# EasyEDA Pro project motor.eprj

# Schematic AO3400V1
Create Date: 2023-12-16; Page Name: AO3400V1; Project Name: motor; Schematic Name: AO3400V1; Update Date: 2023-12-17; Company: 嘉立创EDA; Page Size: A4; Version: V1.0
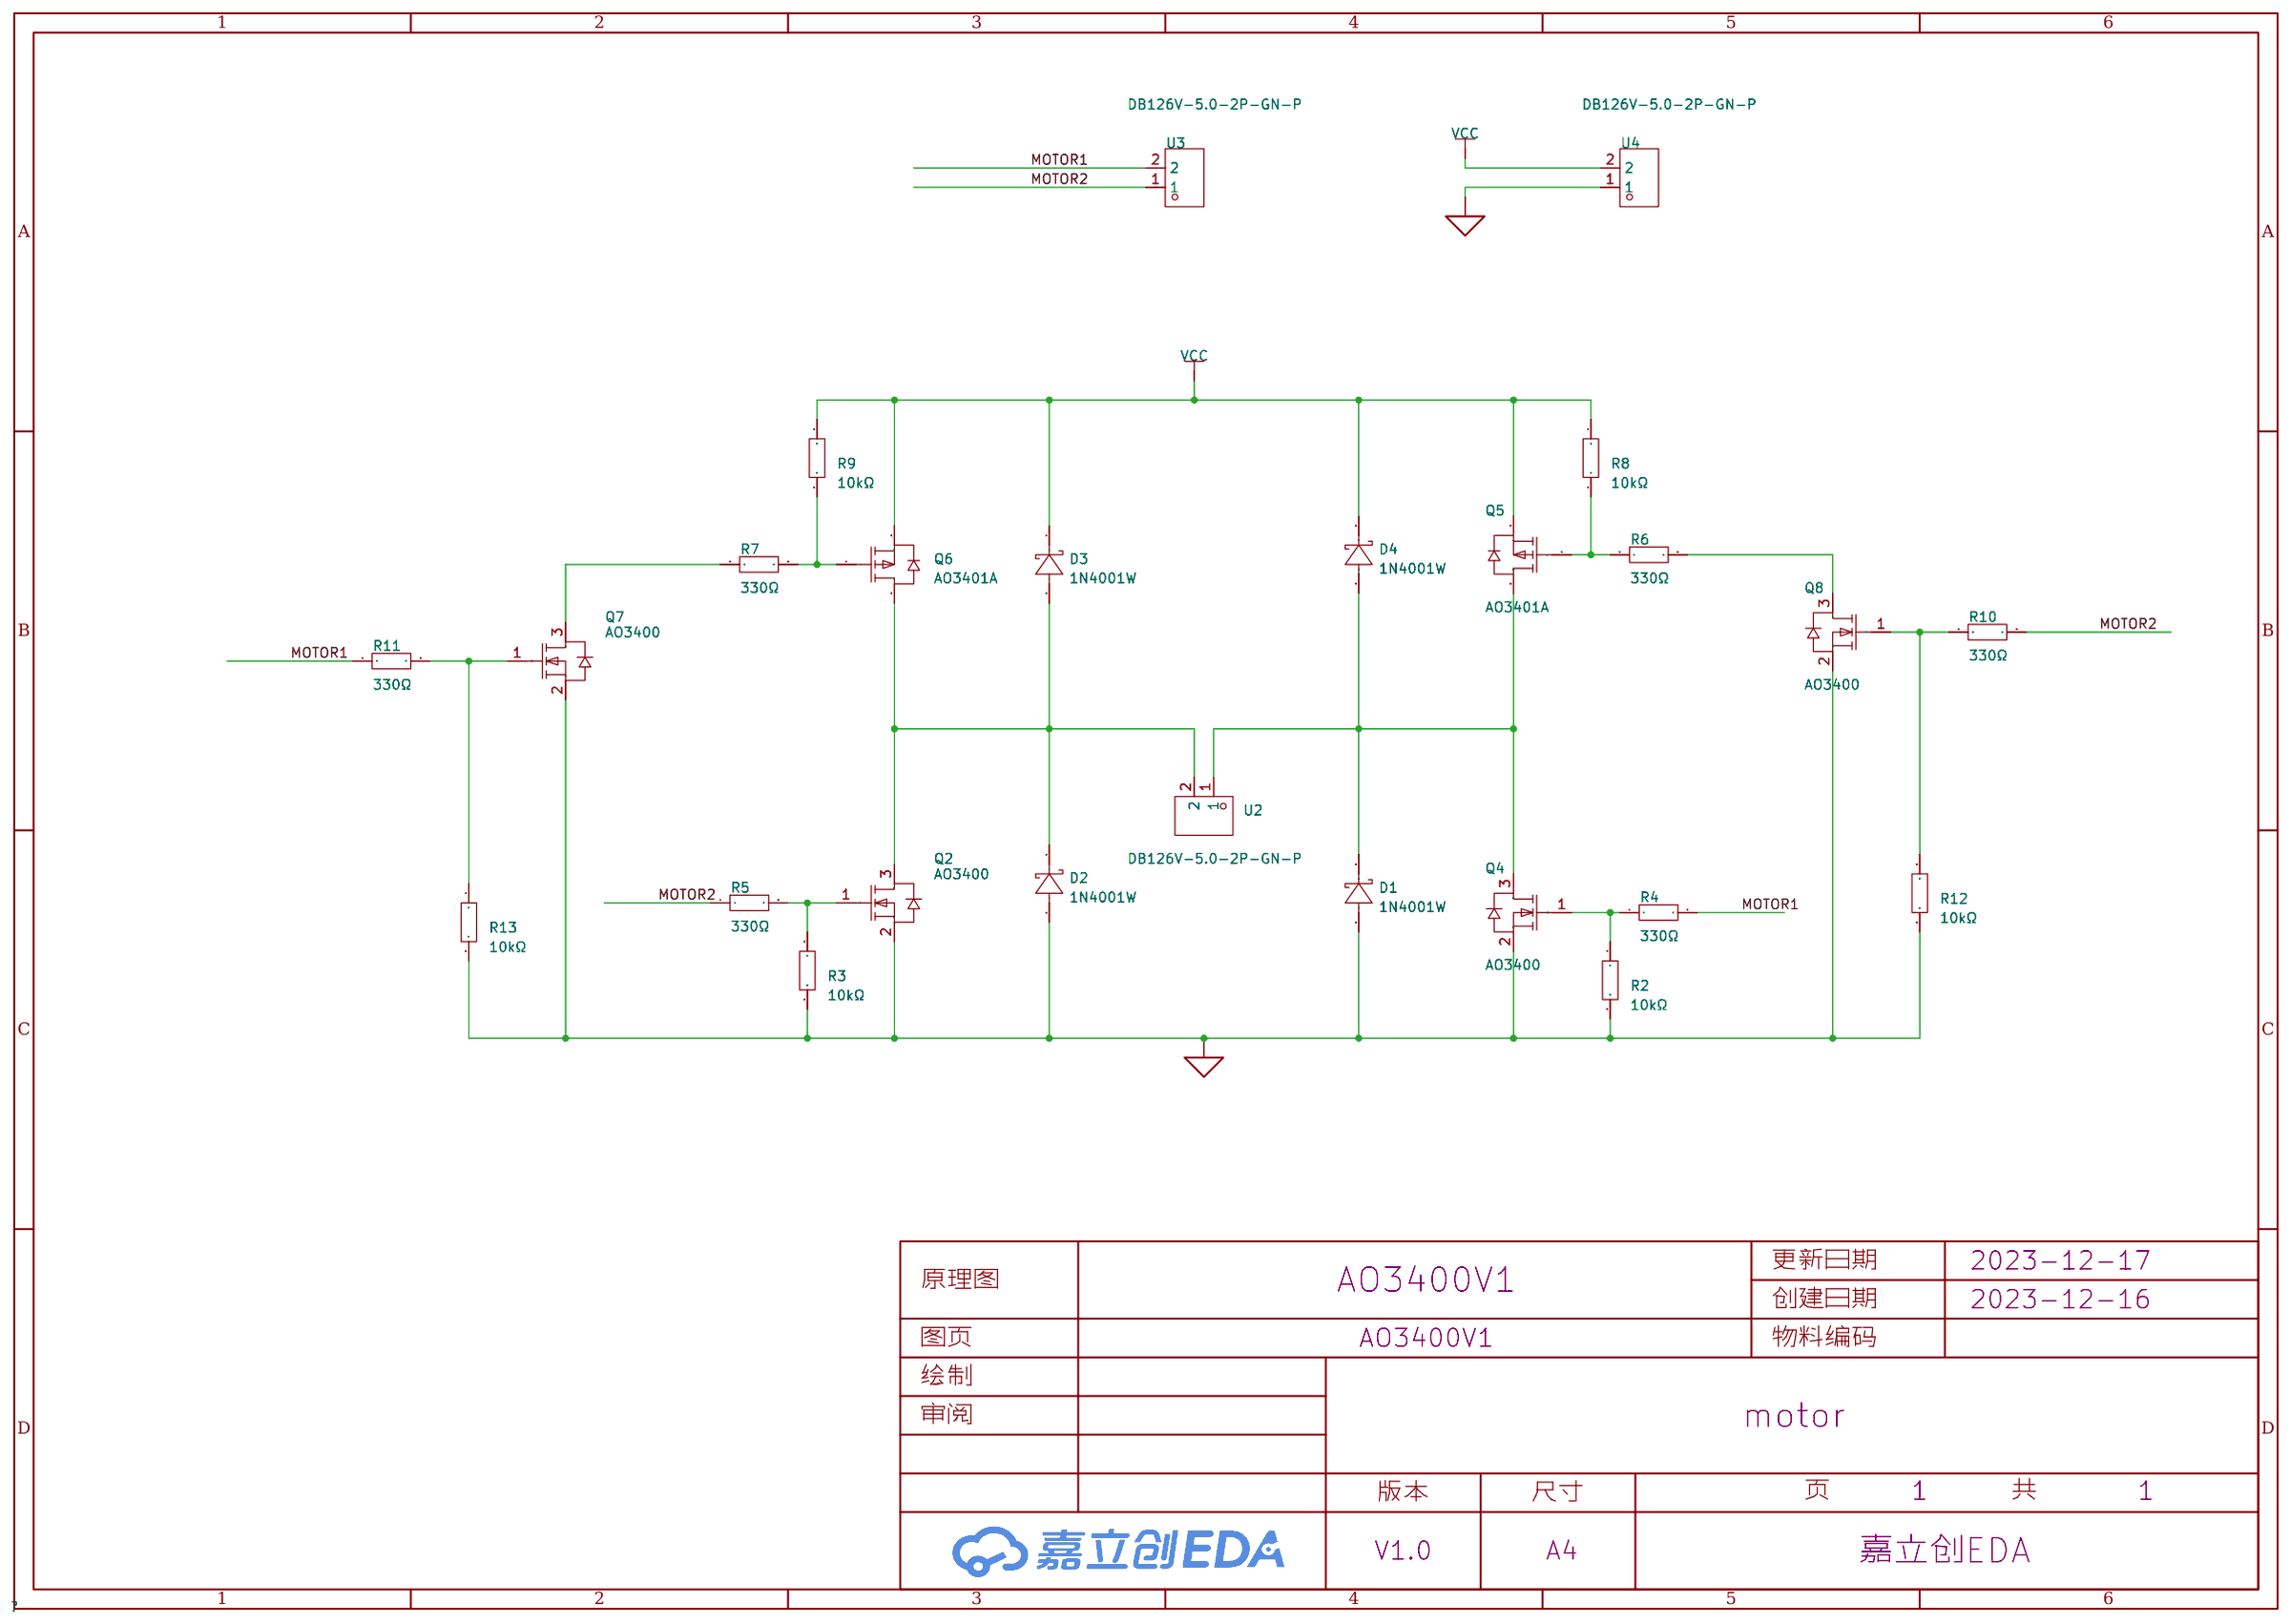
[diagram p0: schematic sheet]

## Parts
D1  1N4001W  [SOD-123FL_L2.7-W1.8-LS3.8-RD]
D2  1N4001W  [SOD-123FL_L2.7-W1.8-LS3.8-RD]
D3  1N4001W  [SOD-123FL_L2.7-W1.8-LS3.8-RD]
D4  1N4001W  [SOD-123FL_L2.7-W1.8-LS3.8-RD]
Q2  AO3400  [SOT-23_L2.9-W1.3-P1.90-LS2.4-BR]
Q4  AO3400  [SOT-23_L2.9-W1.3-P1.90-LS2.4-BR]
Q5  AO3401A  [SOT-23_L2.9-W1.3-P1.90-LS2.4-BR]
Q6  AO3401A  [SOT-23_L2.9-W1.3-P1.90-LS2.4-BR]
Q7  AO3400  [SOT-23_L2.9-W1.3-P1.90-LS2.4-BR]
Q8  AO3400  [SOT-23_L2.9-W1.3-P1.90-LS2.4-BR]
R2  10kΩ  [R0603]
R3  10kΩ  [R0603]
R4  330Ω  [R0603]
R5  330Ω  [R0603]
R6  330Ω  [R0603]
R7  330Ω  [R0603]
R8  10kΩ  [R0603]
R9  10kΩ  [R0603]
R10  330Ω  [R0603]
R11  330Ω  [R0603]
R12  10kΩ  [R0603]
R13  10kΩ  [R0603]
U2  DB126V-5.0-2P-GN-P  [CONN-TH_2P-P5.00_L7.8-W10.0]
U3  DB126V-5.0-2P-GN-P  [CONN-TH_2P-P5.00_L7.8-W10.0]
U4  DB126V-5.0-2P-GN-P  [CONN-TH_2P-P5.00_L7.8-W10.0]

## Library data of the parts
D1-D4 = 1N4001W_C18199085: 二极管配置:独立式;正向压降(Vf):1V@1.0A;直流反向耐压(Vr):50V;平均整流电流(Io):1A;; LCSC Part Name: 电压:50V 电流:1A; Supplier Part: C18199085; Manufacturer: 宏迦橙; Supplier Footprint: SOD-123FL; JLCPCB Part Class: Extended Part; Datasheet: https://atta.szlcsc.com/upload/public/pdf/source/20230925/B0AB2B510D392D7083D021E804ED238F.pdf; Supplier: LCSC; Diode Configuration: 独立式; Forward Voltage (Vf@If): 1V@1.0A; Reverse Voltage (Vr): 50V; Average Rectified Current (Io): 1A; Reverse Leakage Current: 2uA@50V
Q2 Q4 Q7 Q8 = AO3400_C2938367: 类型:N沟道;漏源电压(Vdss):30V;连续漏极电流(Id):5.8A;功率(Pd):1.5W;导通电阻(RDS(on)@Vgs,Id):35mΩ@10V,5.8A;阈值电压(Vgs(th)@Id):1.2V@250uA;; LCSC Part Name: N沟道 耐压:30V 电流:5.8A; Supplier Part: C2938367; Manufacturer: GOODWORK(固得沃克); Supplier Footprint: SOT-23; JLCPCB Part Class: 扩展库; Datasheet: https://atta.szlcsc.com/upload/public/pdf/source/20211229/1DE691E24B5B31BB262C463D0489A9AB.pdf; Supplier: LCSC; Type: N沟道; Drain Source Voltage (Vdss): 30V; Continuous Drain Current (Id): 5.8A; Power Dissipation (Pd): 1.5W; Drain Source On Resistance (RDS(on)@Vgs,Id): 35mΩ@10V,5.8A; Gate Threshold Voltage (Vgs(th)@Id): 1.2V@250uA; Input Capacitance (Ciss@Vds): 1.05nF@15V; Reverse Transfer Capacitance (Crss@Vds): 77pF@15V; Operating Temperature: +150℃@(Tj)
Q5 Q6 = AO3401A_C15127: 类型:1个P沟道;漏源电压(Vdss):30V;连续漏极电流(Id):4A;功率(Pd):1.4W;导通电阻(RDS(on)@Vgs,Id):44mΩ@10V,4.3A;阈值电压(Vgs(th)@Id):1.3V@250uA;; LCSC Part Name: 1个P沟道 耐压:30V 电流:4A; Supplier Part: C15127; Manufacturer: AOS; Supplier Footprint: SOT-23; JLCPCB Part Class: 基础库; Datasheet: https://atta.szlcsc.com/upload/public/pdf/source/20160507/1462613609053.pdf; Supplier: LCSC; Type: 1个P沟道; Drain Source Voltage (Vdss): 30V; Continuous Drain Current (Id): 4A; Power Dissipation (Pd): 1.4W; Drain Source On Resistance (RDS(on)@Vgs,Id): 44mΩ@10V,4.3A; Gate Threshold Voltage (Vgs(th)@Id): 1.3V@250uA; Total Gate Charge (Qg@Vgs): 12.2nC@4.5V; Input Capacitance (Ciss@Vds): 1.2nF@15V; Operating Temperature: -55℃~+150℃@(Tj)
R2 R3 R8 R9 R12 R13 = 0603WAF1002T5E: 阻值:10kΩ;精度:±1%;功率:100mW;温度系数:±100ppm/℃;电阻类型:厚膜电阻;; LCSC Part Name: 10kΩ ±1% 100mW 厚膜电阻; Supplier Part: C25804; Manufacturer: UNI-ROYAL(厚声); Supplier Footprint: 0603; JLCPCB Part Class: 基础库; Datasheet: https://atta.szlcsc.com/upload/public/pdf/source/20200306/C422600_1E6D84923E4A46A82E41ADD87F860B5C.pdf; Supplier: LCSC; Tolerance: ±1%; Power(Watts): 100mW; Overload Voltage (Max): 75V; Temperature Coefficient: ±100ppm/℃; Type: 厚膜电阻; Operating Temperature Range: -55℃~+155℃
R4-R7 R10 R11 = 0603WAF3300T5E: 电阻类型:厚膜电阻;阻值:330Ω;精度:±1%;功率:100mW;最大工作电压:75V;温度系数:±100ppm/℃;; LCSC Part Name: 330Ω ±1% 100mW 厚膜电阻; Supplier Part: C23138; Manufacturer: UNI-ROYAL(厚声); Supplier Footprint: 0603; JLCPCB Part Class: 基础库; Datasheet: https://atta.szlcsc.com/upload/public/pdf/source/20200306/C422600_1E6D84923E4A46A82E41ADD87F860B5C.pdf; Supplier: LCSC; Type: 厚膜电阻; Tolerance: ±1%; Power(Watts): 100mW; Overload Voltage (Max): 75V; Temperature Coefficient: ±100ppm/℃; Operating Temperature Range: -55℃~+155℃
U2-U4 = DB126V-5.0-2P-GN-P: 间距:5mm;结构:1x2P;排数:1;每排PIN数:2;安装方式:直插;额定电流:15A;额定电压:250V;线规 - AWG:14~26;线规 - mm2:1.5;工作温度范围:-40℃~+105℃;颜色:绿色;; LCSC Part Name: 5mm 1x2P 排数:1 每排P数:2 直插; Supplier Part: C395849; Manufacturer: DIBO(地博电气); Supplier Footprint: 插件,P=5mm; JLCPCB Part Class: 扩展库; Datasheet: https://atta.szlcsc.com/upload/public/pdf/source/20230406/A033F46F5FECA00BC1B8D9A3F749A51C.pdf; Supplier: LCSC; Pitch: 5mm; Structure: 1x2P; Number of Rows: 1; Number of PINs Per Row: 2; Mounting Style: 直插; Current Rating (Max): 15A; Voltage Rating (Max): 250V; Wire Gauge - AWG: 14~26; Wire Gauge - mm2: 1.5; Operating Temperature Range: -40℃~+105℃; Color: 绿色; Number of Pins: 2P

## Nets
AGND: D1.2(A) D2.2(A) Q2.2(S) Q4.2(S) Q7.2(S) Q8.2(S) R2.2 R3.2 R12.2 R13.2 U4.1
VCC: D3.1(K) D4.1(K) Q5.2(S) Q6.2(S) R8.1 R9.1 U4.2
MOTOR1: R4.2 R11.1 U3.2
MOTOR2: R5.1 R10.2 U3.1
$1N1584: Q2.1(G) R3.1 R5.2
$1N1607: D2.1(K) D3.2(A) Q2.3(D) Q6.3(D) U2.2
$1N1619: Q4.1(G) R2.1 R4.1
$1N1736: D1.1(K) D4.2(A) Q4.3(D) Q5.3(D) U2.1
$1N2290: Q5.1(G) R6.1 R8.2
$1N2329: Q6.1(G) R7.2 R9.2
$1N2487: Q7.3(D) R7.1
$1N2533: Q8.3(D) R6.2
$1N2573: Q8.1(G) R10.1 R12.1
$1N2612: Q7.1(G) R11.2 R13.1

# Schematic SS8050V1
Create Date: 2024-06-09; Page Name: P1; Project Name: motor; Schematic Name: SS8050V1; Update Date: 2024-06-09; Company: 嘉立创EDA; Page Size: A4; Version: V1.0
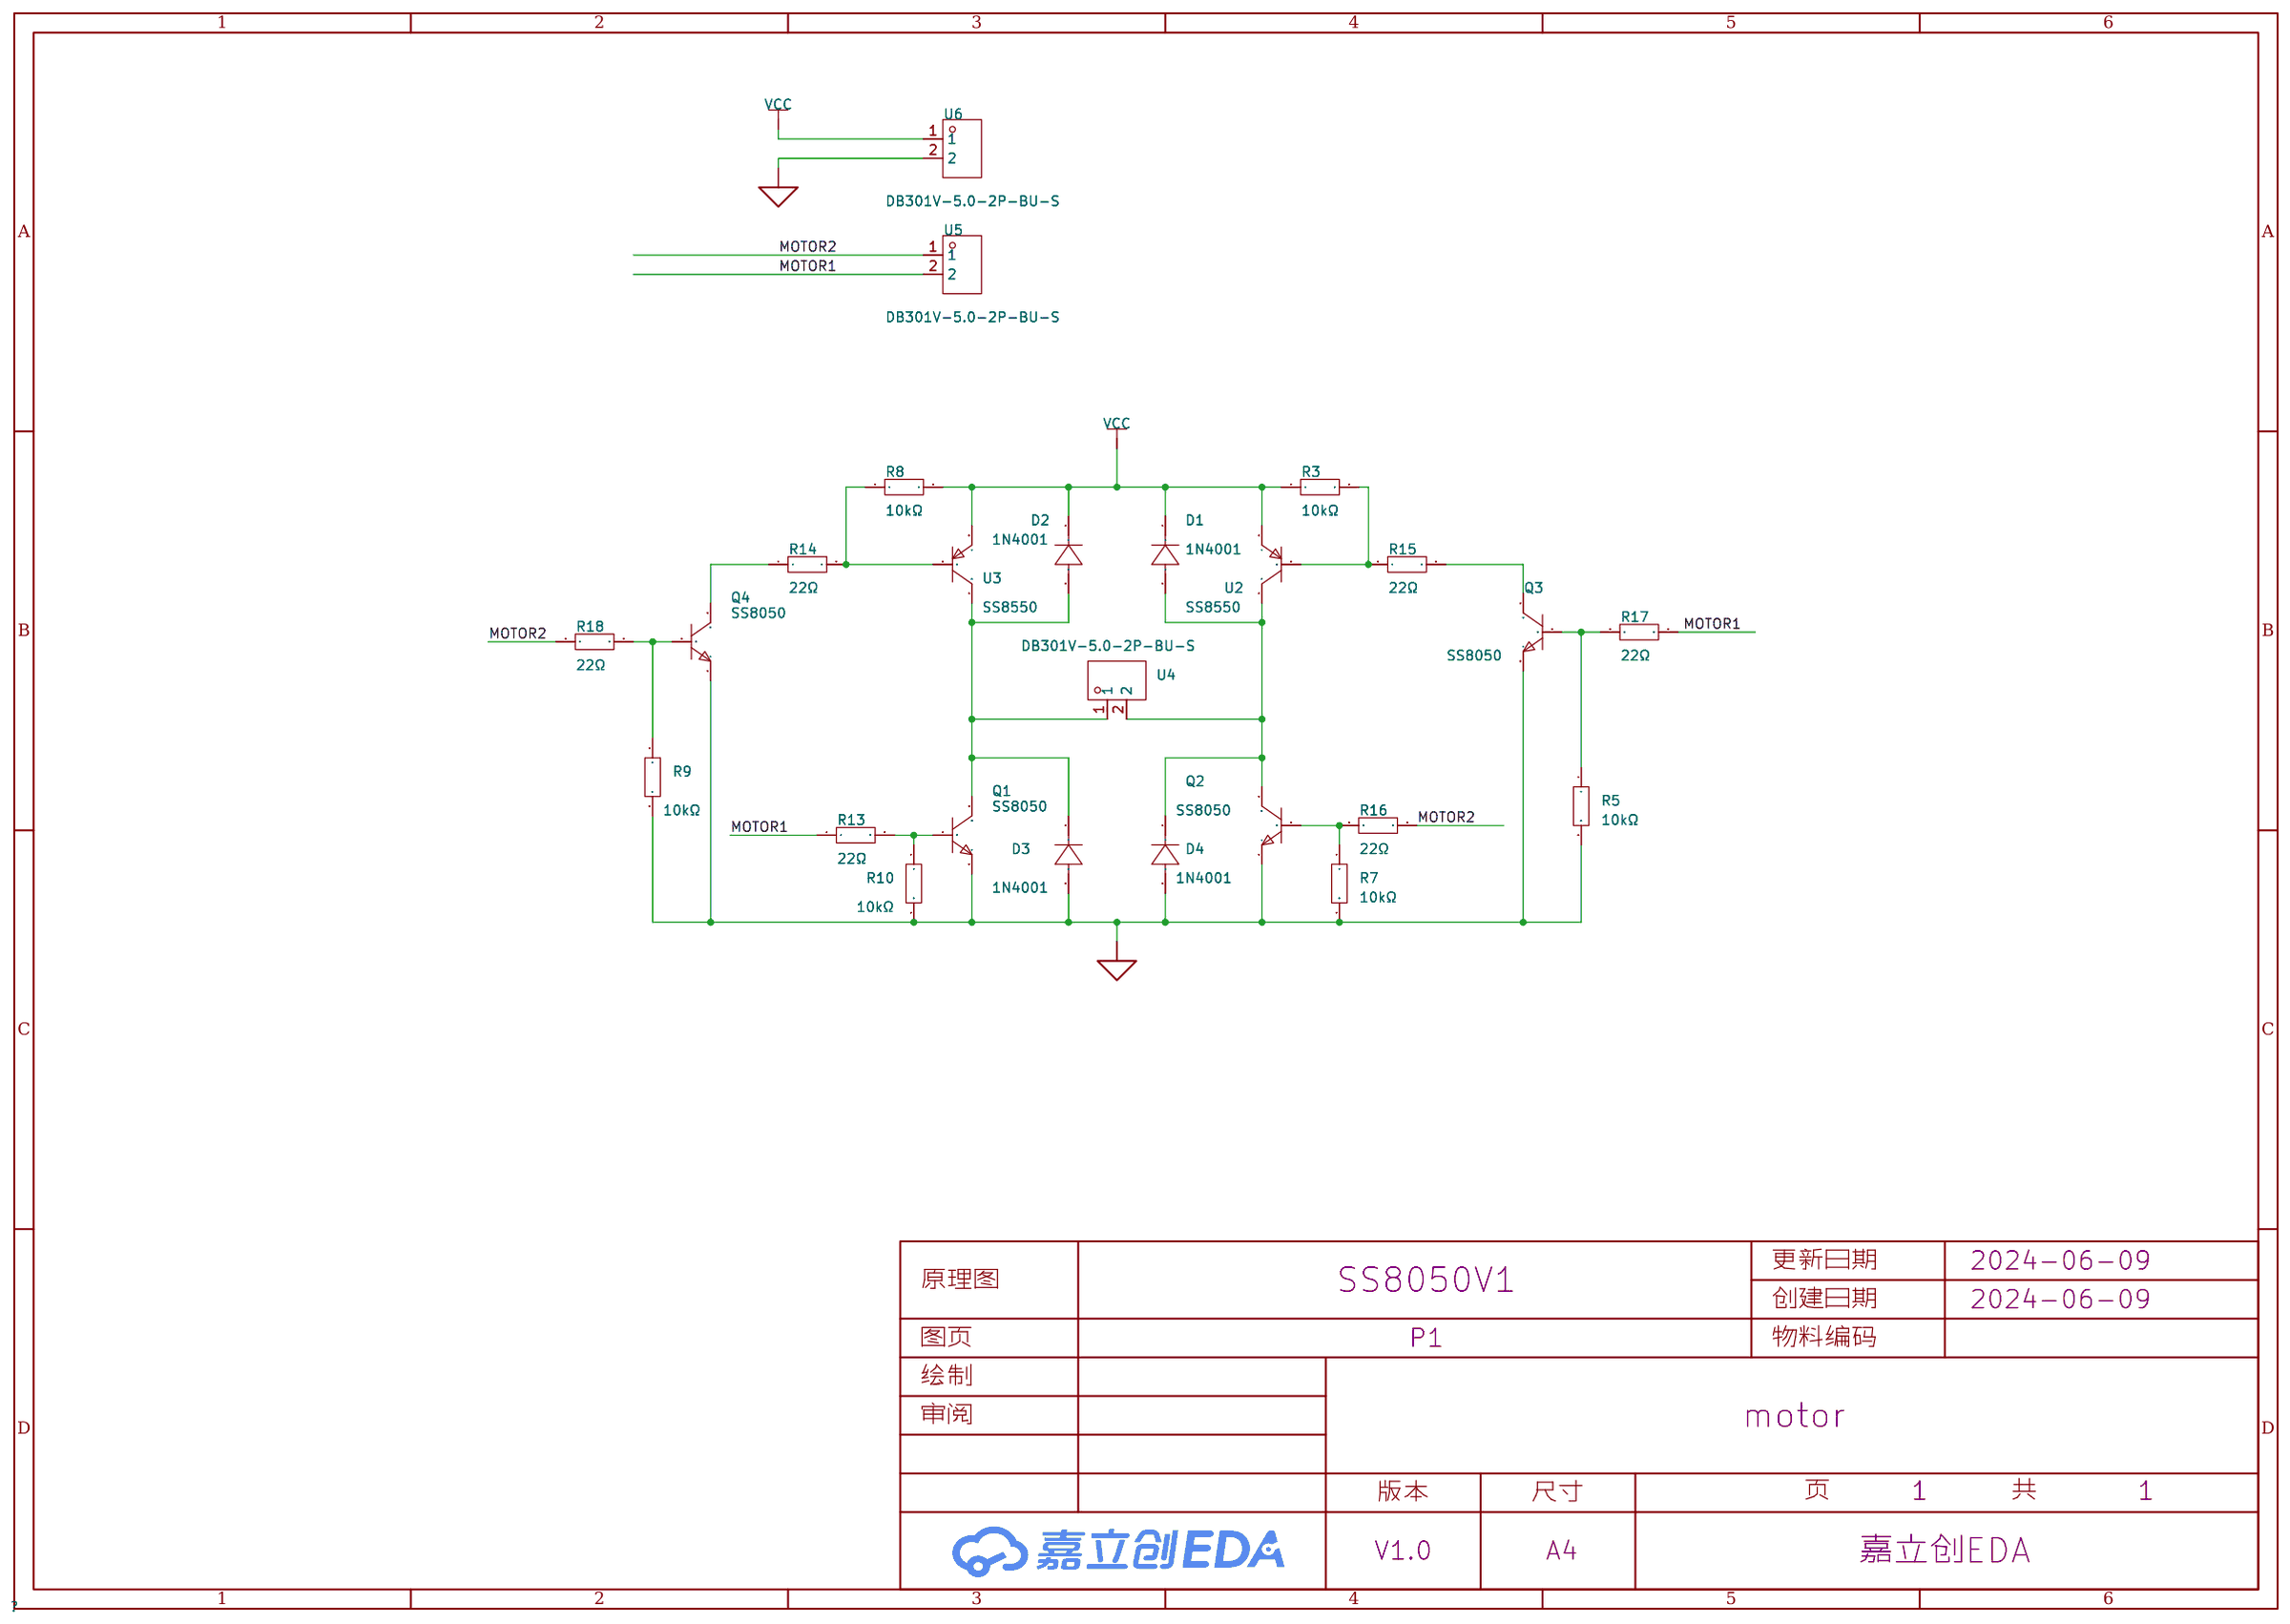
[diagram p1: schematic sheet]

## Parts
D1  1N4001  [SMA_L4.3-W2.5-LS5.0-RD]
D2  1N4001  [SMA_L4.3-W2.5-LS5.0-RD]
D3  1N4001  [SMA_L4.3-W2.5-LS5.0-RD]
D4  1N4001  [SMA_L4.3-W2.5-LS5.0-RD]
Q1  SS8050  [SOT-23-3_L2.9-W1.3-P1.90-LS2.4-BR]
Q2  SS8050  [SOT-23-3_L2.9-W1.3-P1.90-LS2.4-BR]
Q3  SS8050  [SOT-23-3_L2.9-W1.3-P1.90-LS2.4-BR]
Q4  SS8050  [SOT-23-3_L2.9-W1.3-P1.90-LS2.4-BR]
R3  10kΩ  [R0603]
R5  10kΩ  [R0603]
R7  10kΩ  [R0603]
R8  10kΩ  [R0603]
R9  10kΩ  [R0603]
R10  10kΩ  [R0603]
R13  22Ω  [R0603]
R14  22Ω  [R0603]
R15  22Ω  [R0603]
R16  22Ω  [R0603]
R17  22Ω  [R0603]
R18  22Ω  [R0603]
U2  SS8550  [SOT-23-3_L2.9-W1.3-P1.90-LS2.4-BR]
U3  SS8550  [SOT-23-3_L2.9-W1.3-P1.90-LS2.4-BR]
U4  DB301V-5.0-2P-BU-S  [CONN-TH_2P-P5.00_L7.6-W10.0]
U5  DB301V-5.0-2P-BU-S  [CONN-TH_2P-P5.00_L7.6-W10.0]
U6  DB301V-5.0-2P-BU-S  [CONN-TH_2P-P5.00_L7.6-W10.0]

## Library data of the parts
D1-D4 = 1N4001_C727079: 二极管配置:独立式;正向压降(Vf):1.1V@1A;直流反向耐压(Vr):50V;平均整流电流(Io):1A;; LCSC Part Name: 电压:50V 电流:1A; Supplier Part: C727079; Manufacturer: TWGMC(台湾迪嘉); Supplier Footprint: SMA(DO-214AC); JLCPCB Part Class: 扩展库; Datasheet: https://atta.szlcsc.com/upload/public/pdf/source/20200828/C727079_3A05254382567072883400655AE0ED46.pdf; Supplier: LCSC; Diode Configuration: 独立式; Forward Voltage (Vf@If): 1.1V@1A; Reverse Voltage (Vr): 50V; Average Rectified Current (Io): 1A; Reverse Leakage Current: 5uA@50V
Q1-Q4 = SS8050_C2150: 晶体管类型:NPN;集电极电流(Ic):1.5A;集射极击穿电压(Vceo):25V;功率(Pd):300mW;直流电流增益(hFE@Ic,Vce):200@100mA,1V;; LCSC Part Name: SS8050(RANGE:200-350) hfe=200~350; Supplier Part: C2150; Manufacturer: CJ(江苏长电/长晶); Supplier Footprint: SOT-23; JLCPCB Part Class: 基础库; Datasheet: https://atta.szlcsc.com/upload/public/pdf/source/20230322/AEE86F4B043774EFF80CAEA14A37D9E9.pdf; Supplier: LCSC; Transistor Type: NPN; Collector Current (Ic): 1.5A; Collector-Emitter Breakdown Voltage (Vceo): 25V; Power Dissipation (Pd): 300mW; DC Current Gain (hFE@Ic,Vce): 200@100mA,1V; Transition Frequency (fT): 100MHz; Collector Cut-Off Current (Icbo): 100nA; Collector-Emitter Saturation Voltage (VCE(sat)@Ic,Ib): 500mV@800mA,80mA
R3 R5 R7-R10 = 0603WAF1002T5E: 电阻类型:厚膜电阻;阻值:10kΩ;精度:±1%;功率:100mW;最大工作电压:75V;温度系数:±100ppm/℃;; LCSC Part Name: 10kΩ ±1% 100mW 厚膜电阻; Supplier Part: C25804; Manufacturer: UNI-ROYAL(厚声); Supplier Footprint: 0603; JLCPCB Part Class: 基础库; Datasheet: https://atta.szlcsc.com/upload/public/pdf/source/20200306/C422600_1E6D84923E4A46A82E41ADD87F860B5C.pdf; Supplier: LCSC; Tolerance: ±1%; Power(Watts): 100mW; Overload Voltage (Max): 75V; Temperature Coefficient: ±100ppm/℃; Type: 厚膜电阻; Operating Temperature Range: -55℃~+155℃
R13-R18 = 0603WAF220JT5E: 电阻类型:厚膜电阻;阻值:22Ω;精度:±1%;功率:100mW;最大工作电压:75V;温度系数:±100ppm/℃;; LCSC Part Name: 22Ω ±1% 100mW 厚膜电阻; Supplier Part: C23345; Manufacturer: UNI-ROYAL(厚声); Supplier Footprint: 0603; JLCPCB Part Class: 基础库; Datasheet: https://atta.szlcsc.com/upload/public/pdf/source/20200306/C422600_1E6D84923E4A46A82E41ADD87F860B5C.pdf; Supplier: LCSC; Type: 厚膜电阻; Tolerance: ±1%; Power(Watts): 100mW; Overload Voltage (Max): 75V; Temperature Coefficient: ±100ppm/℃; Operating Temperature Range: -55℃~+155℃
U2 U3 = SS8550_C7420371: 晶体管类型:PNP;集电极电流(Ic):1.5A;集射极击穿电压(Vceo):25V;功率(Pd):300mW;直流电流增益(hFE@Ic,Vce):120@100mA,1.0V;; LCSC Part Name: 耐压:25V 电流:1.5A PNP H档 200-350; Supplier Part: C7420371; Manufacturer: 宏迦橙; Supplier Footprint: SOT-23; JLCPCB Part Class: 扩展库; Datasheet: https://atta.szlcsc.com/upload/public/pdf/source/20231222/5BDA6DBF3A79C59009F81F0EEE6F8969.pdf; Supplier: LCSC; Transistor Type: PNP; Collector Current (Ic): 1.5A; Collector-Emitter Breakdown Voltage (Vceo): 25V; Power Dissipation (Pd): 300mW; DC Current Gain (hFE@Ic,Vce): 120@100mA,1.0V; Transition Frequency (fT): 100MHz; Collector Cut-Off Current (Icbo): 100nA; Collector-Emitter Saturation Voltage (VCE(sat)@Ic,Ib): 500mV@800mA,80mA; Operating Temperature: -55℃~+150℃
U4-U6 = DB301V-5.0-2P-BU-S: 结构:1x2P;间距:5mm;颜色:蓝色;安装方式:直插;额定电流:17.5A;额定电压:250V;排数:1;线规 - AWG:14~22;线规 - 平方毫米:1.5;每排PIN数:2;工作温度范围:-40℃~+120℃;; LCSC Part Name: 5mm 1x2P 排数:1 每排P数:2 直插; Supplier Part: C395882; Manufacturer: DORABO(地博电气); Supplier Footprint: 插件,P=5mm; JLCPCB Part Class: 扩展库; Datasheet: https://atta.szlcsc.com/upload/public/pdf/source/20230321/D511151DA9A574FE7610C3CBEF6C1AC3.pdf; Supplier: LCSC; Structure: 1x2P; Pitch: 5mm; Color: 蓝色; Mounting Style: 直插; Current Rating (Max): 17.5A; Voltage Rating (Max): 250V; Number of Pins: 2P; Number of Rows: 1; Wire Gauge - AWG: 14~22; Wire Gauge - mm2: 1.5; Number of PINs Per Row: 2; Operating Temperature Range: -40℃~+120℃

## Nets
AGND: D3.2(A) D4.2(A) Q1.2(E) Q2.2(E) Q3.2(E) Q4.2(E) R5.2 R7.2 R9.2 R10.2 U6.2
VCC: D1.1(K) D2.1(K) R3.1 R8.2 U2.2(E) U3.2(E) U6.1
MOTOR1: R13.1 R17.2 U5.2
MOTOR2: R16.2 R18.1 U5.1
$1N936: D2.2(A) D3.1(K) Q1.3(C) U3.3(C) U4.1
$1N937: D1.2(A) D4.1(K) Q2.3(C) U2.3(C) U4.2
$1N939: R3.2 R15.1 U2.1(B)
$1N940: R8.1 R14.2 U3.1(B)
$1N941: Q3.3(C) R15.2
$1N942: Q3.1(B) R5.1 R17.1
$1N945: Q2.1(B) R7.1 R16.1
$1N948: Q4.3(C) R14.1
$1N949: Q1.1(B) R10.1 R13.2
$1N952: Q4.1(B) R9.1 R18.2

# Board AO3400V1
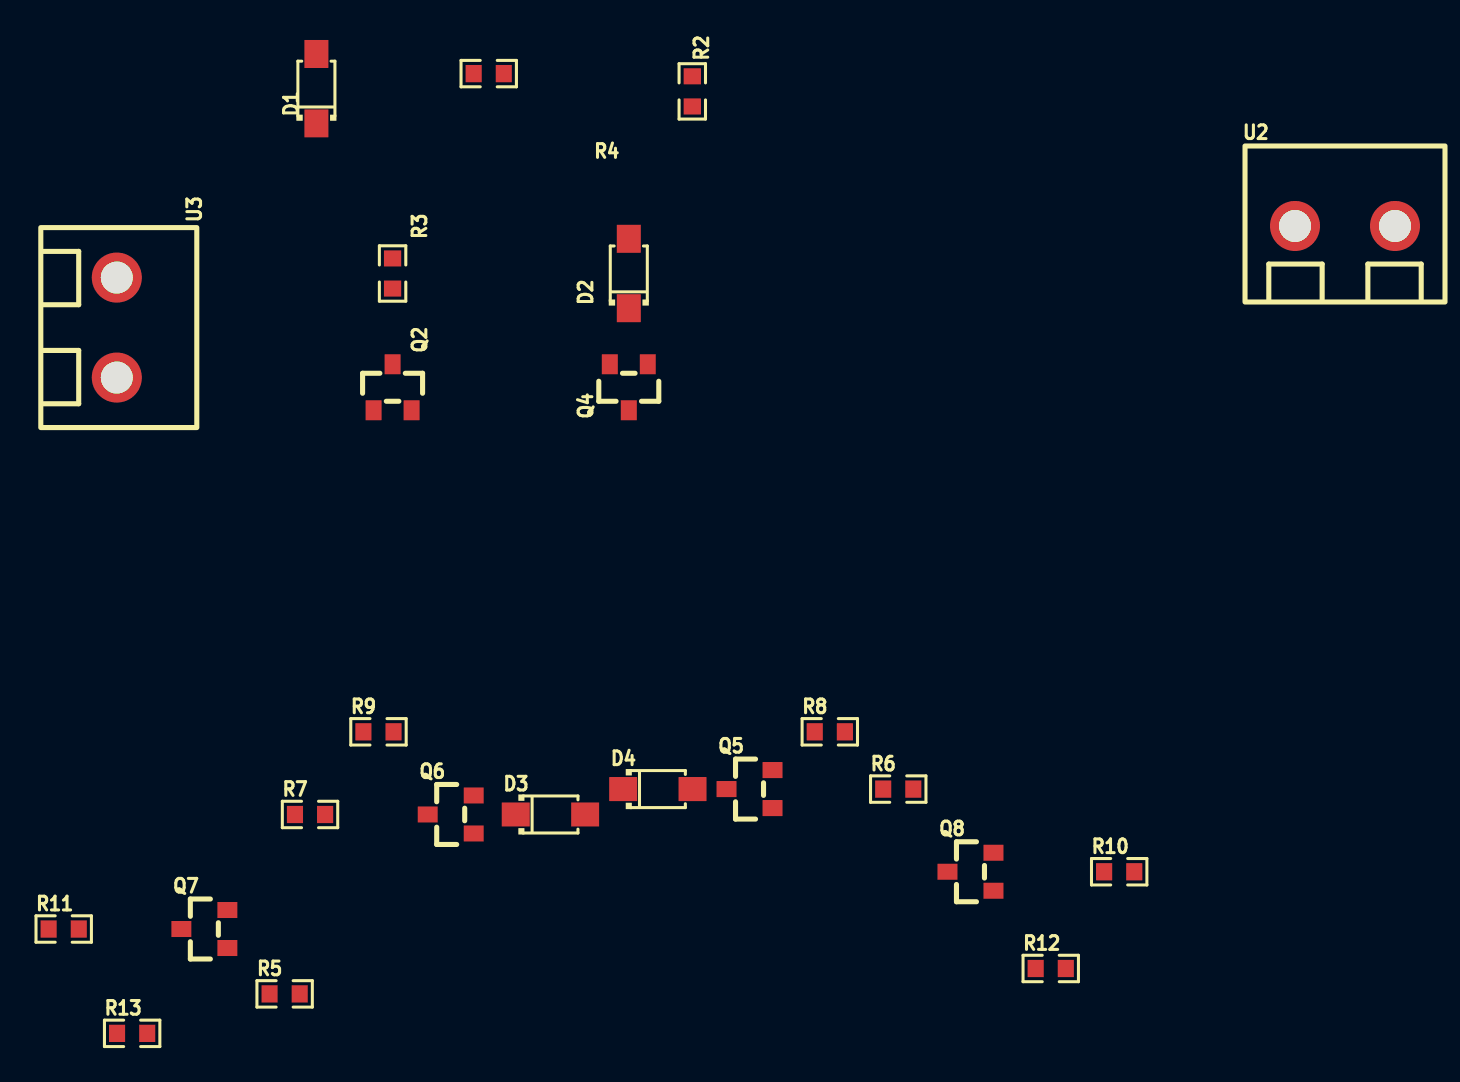
[diagram p2: board, top side]
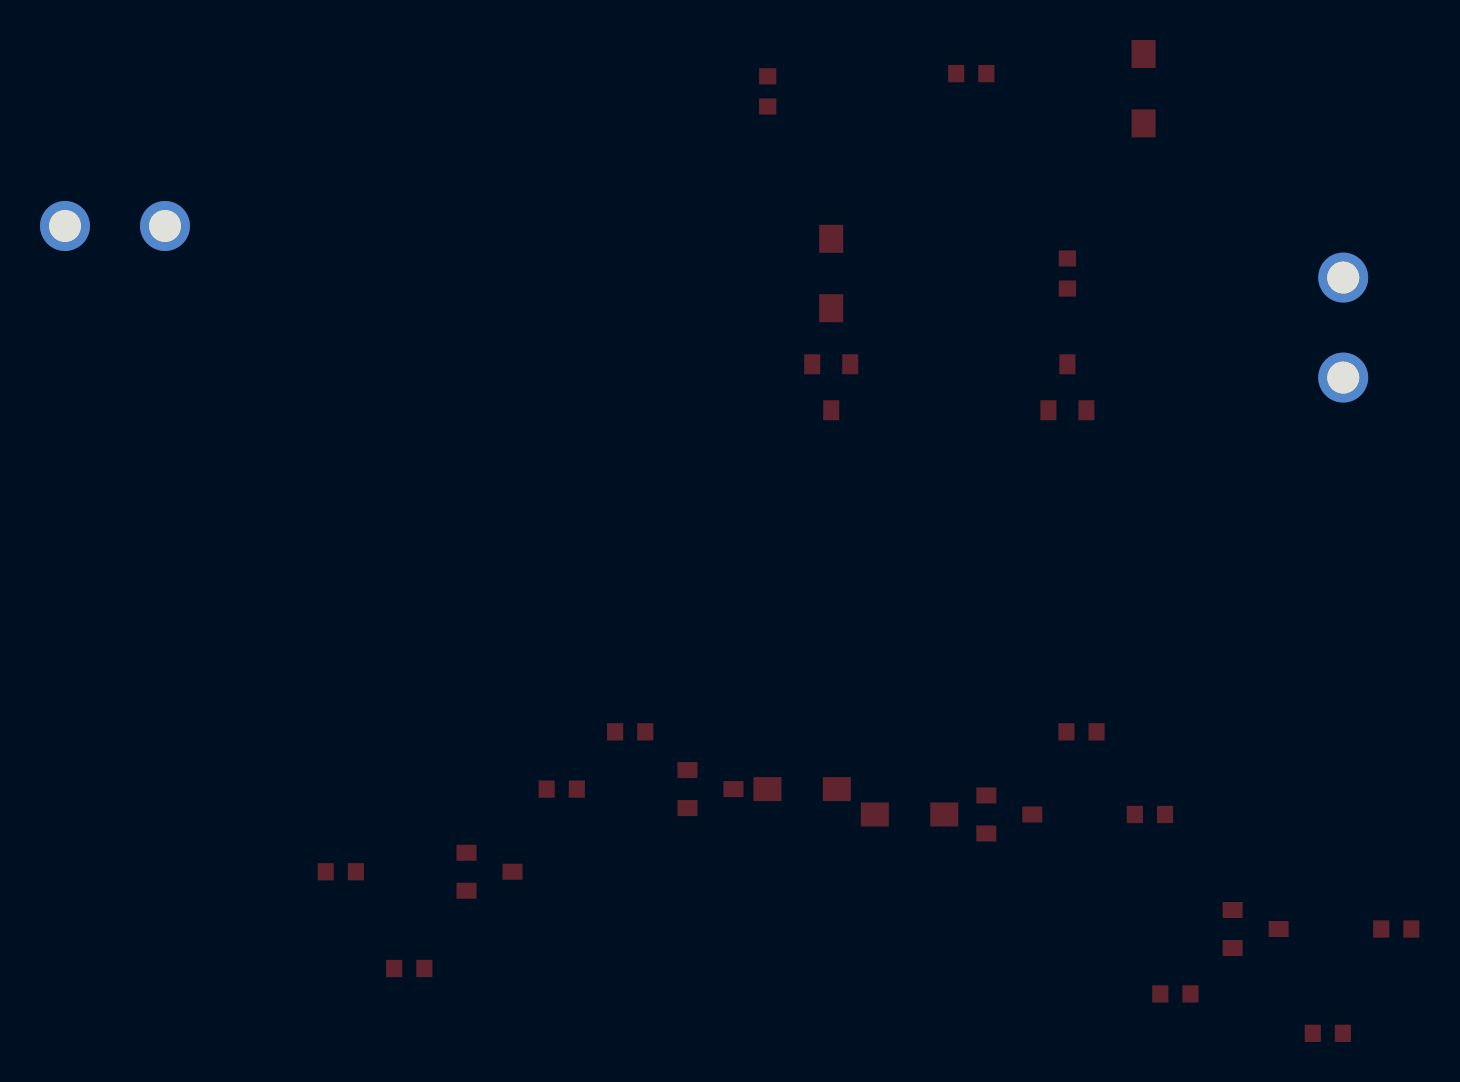
[diagram p3: board, bottom side, seen from below]

No outline. copper layers: Top Layer, Bottom Layer. Coordinates in mm from the lowest, leftmost part position.
Stack: Top Layer 0.035mm / Dielectric1 1.51mm FR4 er 4.5 / Bottom Layer 0.035mm

## Design rules (mm)
template: JLCPCB Capability(Two Layers Board)
spacing copperThickness1oz (default): track to track 0.102, other pairs 0.152 to 0.3
spacing copperThickness2oz: track to track 0.203, other pairs 0.152 to 0.3
track width copperThickness1oz (default): min 0.127, default 0.254, max 2.54
track width copperThickness2oz: min 0.203, default 0.254, max 2.54
differential pair differentialPair (default): width min 0.127, default 0.254, max 2.54; gap min 0.152, default 0.152
via viaSize (default): diameter min 0.5, default 0.61, max 10; hole min 0.3, default 0.305, max 6.3

## Placement (name value [footprint] x y rotation side)
D1  1N4001W  [SOD-123FL_L2.7-W1.8-LS3.8-RD]  12.64 47.24 90 top
D2  1N4001W  [SOD-123FL_L2.7-W1.8-LS3.8-RD]  28.26 38 90 top
D3  1N4001W  [SOD-123FL_L2.7-W1.8-LS3.8-RD]  24.34 10.95 0 top
D4  1N4001W  [SOD-123FL_L2.7-W1.8-LS3.8-RD]  29.71 12.22 0 top
Q2  AO3400  [SOT-23_L2.9-W1.3-P1.90-LS2.4-BR]  16.45 32.31 270 top
Q4  AO3400  [SOT-23_L2.9-W1.3-P1.90-LS2.4-BR]  28.26 32.31 90 top
Q5  AO3401A  [SOT-23_L2.9-W1.3-P1.90-LS2.4-BR]  34.29 12.22 0 top
Q6  AO3401A  [SOT-23_L2.9-W1.3-P1.90-LS2.4-BR]  19.35 10.95 0 top
Q7  AO3400  [SOT-23_L2.9-W1.3-P1.90-LS2.4-BR]  7.03 5.22 0 top
Q8  AO3400  [SOT-23_L2.9-W1.3-P1.90-LS2.4-BR]  45.34 8.08 0 top
R2  10kΩ  [R0603]  31.43 47.1 270 top
R3  10kΩ  [R0603]  16.45 38 270 top
R4  330Ω  [R0603]  21.25 47.99 180 top
R5  330Ω  [R0603]  11.05 1.97 0 top
R6  330Ω  [R0603]  41.73 12.22 0 top
R7  330Ω  [R0603]  12.32 10.95 0 top
R8  10kΩ  [R0603]  38.31 15.08 0 top
R9  10kΩ  [R0603]  15.74 15.08 0 top
R10  330Ω  [R0603]  52.78 8.08 0 top
R11  330Ω  [R0603]  0 5.22 0 top
R12  10kΩ  [R0603]  49.36 3.24 0 top
R13  10kΩ  [R0603]  3.42 0 0 top
U2  DB126V-5.0-2P-GN-P  [CONN-TH_2P-P5.00_L7.8-W10.0]  64.07 40.37 0 top
U3  DB126V-5.0-2P-GN-P  [CONN-TH_2P-P5.00_L7.8-W10.0]  2.66 35.29 270 top

## Footprints (pads in the part's own frame, mm; a bottom-side part is the same pattern mirrored in y, then rotated)
CONN-TH_2P-P5.00_L7.8-W10.0
  round 2.5 hole 1.6: 1(-2.5,0) 2(2.5,0)
R0603
  rect 0.806x0.864 smd: 1(-0.753,0) 2(0.753,0)
SOD-123FL_L2.7-W1.8-LS3.8-RD
  rect 1.4x1.2 smd: 1(-1.735,0) 2(1.735,0)
SOT-23_L2.9-W1.3-P1.90-LS2.4-BR
  rect 1x0.8 smd: 1(1.15,-0.95) 2(1.15,0.95) 3(-1.15,0)

## Nets
As in the schematic.

# Board SS8050V1
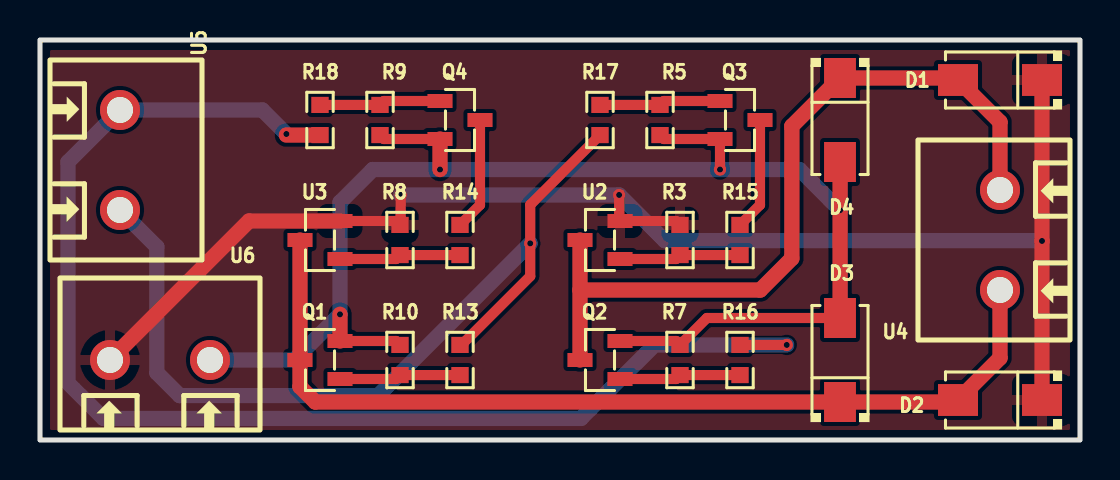
[diagram p4: board, top side]
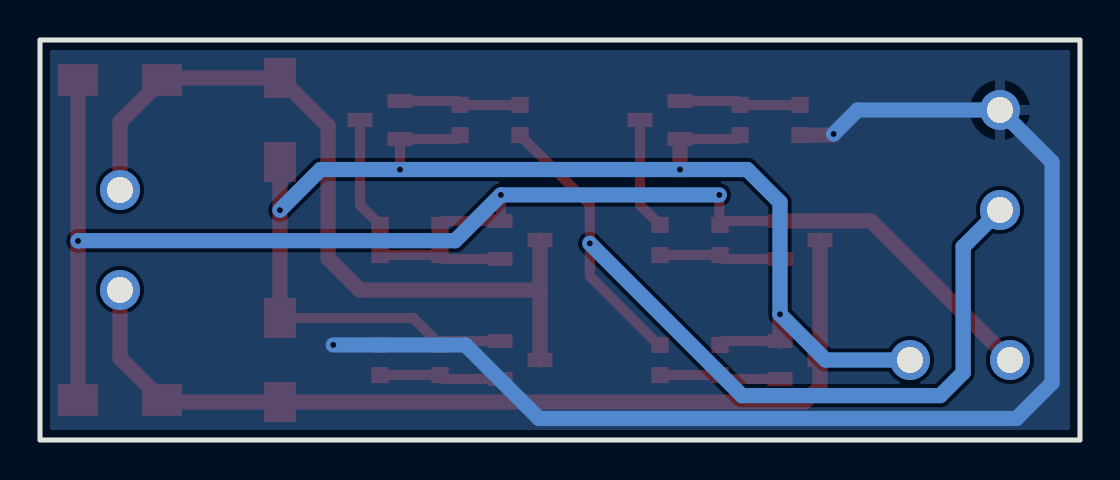
[diagram p5: board, bottom side, seen from below]

Outline 52 x 20 mm; copper layers: Top Layer, Bottom Layer. Coordinates in mm from the lower left corner of the outline.
Outline path: rectangle 0,20 52,0
Stack: Top Layer 0.035mm / Dielectric1 1.51mm FR4 er 4.5 / Bottom Layer 0.035mm

## Design rules (mm)
template: JLCPCB Capability(Two Layers Board)
spacing copperThickness1oz (default): track to track 0.102, other pairs 0.152 to 0.3
spacing copperThickness2oz: track to track 0.203, other pairs 0.152 to 0.3
track width copperThickness1oz (default): min 0.127, default 0.254, max 2.54
track width copperThickness2oz: min 0.203, default 0.254, max 2.54
differential pair differentialPair (default): width min 0.127, default 0.254, max 2.54; gap min 0.152, default 0.152
via viaSize (default): diameter min 0.5, default 0.61, max 10; hole min 0.3, default 0.305, max 6.3

## Placement (name value [footprint] x y rotation side)
D1  1N4001  [SMA_L4.3-W2.5-LS5.0-RD]  48 18 180 top
D2  1N4001  [SMA_L4.3-W2.5-LS5.0-RD]  48 2 180 top
D3  1N4001  [SMA_L4.3-W2.5-LS5.0-RD]  40 4 90 top
D4  1N4001  [SMA_L4.3-W2.5-LS5.0-RD]  40 16 270 top
Q1  SS8050  [SOT-23-3_L2.9-W1.3-P1.90-LS2.4-BR]  14 4 0 top
Q2  SS8050  [SOT-23-3_L2.9-W1.3-P1.90-LS2.4-BR]  28 4 0 top
Q3  SS8050  [SOT-23-3_L2.9-W1.3-P1.90-LS2.4-BR]  35 16 180 top
Q4  SS8050  [SOT-23-3_L2.9-W1.3-P1.90-LS2.4-BR]  21 16 180 top
R3  10kΩ  [R0603]  32 10 270 top
R5  10kΩ  [R0603]  31 16 270 top
R7  10kΩ  [R0603]  32 4 90 top
R8  10kΩ  [R0603]  18 10 90 top
R9  10kΩ  [R0603]  17 16 270 top
R10  10kΩ  [R0603]  18 4 90 top
R13  22Ω  [R0603]  21 4 270 top
R14  22Ω  [R0603]  21 10 270 top
R15  22Ω  [R0603]  35 10 90 top
R16  22Ω  [R0603]  35 4 90 top
R17  22Ω  [R0603]  28 16 270 top
R18  22Ω  [R0603]  14 16 90 top
U2  SS8550  [SOT-23-3_L2.9-W1.3-P1.90-LS2.4-BR]  28 10 0 top
U3  SS8550  [SOT-23-3_L2.9-W1.3-P1.90-LS2.4-BR]  14 10 0 top
U4  DB301V-5.0-2P-BU-S  [CONN-TH_2P-P5.00_L7.6-W10.0]  48 10 90 top
U5  DB301V-5.0-2P-BU-S  [CONN-TH_2P-P5.00_L7.6-W10.0]  4 14 270 top
U6  DB301V-5.0-2P-BU-S  [CONN-TH_2P-P5.00_L7.6-W10.0]  6 4 0 top

## Footprints (pads in the part's own frame, mm; a bottom-side part is the same pattern mirrored in y, then rotated)
CONN-TH_2P-P5.00_L7.6-W10.0
  round 2 hole 1.3: 1(-2.5,0) 2(2.5,0)
R0603
  rect 0.806x0.864 smd: 1(-0.753,0) 2(0.753,0)
SMA_L4.3-W2.5-LS5.0-RD
  rect 2x1.593 smd: 1(-2.1,0) 2(2.1,0)
SOT-23-3_L2.9-W1.3-P1.90-LS2.4-BR
  rect 1.25x0.7 smd: 1(1,-0.95) 2(1,0.95) 3(-1,0)

## Nets
As in the schematic.

## Via types
v1: diameter 0.61, hole 0.305, Top Layer to Bottom Layer, 10 vias

## Routing (per net, layer and track width the routed paths; a pad name or vN(x,y) marks a point on that pad's centre or on a via; arc(x,y) is an arc through that point)
AGND: length 72.6
  Top Layer w0.508: R10.2 17.8,4.95 Q1.2 ; D3.2 33.35,6.1 R7.2 31.8,4.95 Q2.2 ; R9.2 17.2,15.05 Q4.2 ; R5.2 31.2,15.05 Q3.2 v1(34,13.52)
  Top Layer w0.762: D3.2 40,6.11 v1(40,11.49) 40,13.89 D4.2 ; Q4.2 v1(20,13.52) ; Q1.2 v1(15,6.28)
  Bottom Layer w0.762: v1(40,11.49) 37.97,13.52 v1(34,13.52) v1(20,13.52) 16.64,13.52 15,11.89 v1(15,6.28) 12.72,4 U6.2
VCC: length 72.4
  Top Layer w0.508: U3.2 17.8,10.95 R8.2 18.03,10.79 v1(18.03,12.25) ; v1(28.96,12.25) 28.96,10.99 U2.2 31.8,10.95 R3.1
  Top Layer w0.762: D2.1 v1(50.1,9.95) D1.1 ; U6.1 10.45,10.95 U3.2
  Bottom Layer w0.762: v1(18.03,12.25) v1(28.96,12.25) 31.24,9.97 50.08,9.97 v1(50.1,9.95)
MOTOR1: length 44.6
  Top Layer w0.508: R17.2 24.51,11.76 v1(24.51,9.83) 24.51,8.19 21.08,4.75 R13.1
  Bottom Layer w0.762: v1(24.51,9.83) 16.9,2.22 6.98,2.22 5.84,3.36 5.84,9.66 U5.2
MOTOR2: length 65.8
  Top Layer w0.508: R16.2 v1(37.34,4.75)
  Top Layer w0.762: R18.1 12.32,15.25
  Bottom Layer w0.762: v1(37.34,4.75) 30.73,4.75 27.05,1.08 3.17,1.08 1.4,2.86 1.4,13.9 U5.1 11.12,16.5 v1(12.32,15.3)
$1N936: length 47
  Top Layer w0.762: U3.3 Q1.3 13,2.66 13.76,1.9 D3.1 45.8,1.9 D2.2 48,4.1 U4.1
$1N937: length 39.6
  Top Layer w0.762: U4.2 48,15.9 D1.2 45.8,18.1 D4.1 37.59,15.69 37.59,9.08 36.01,7.5 27,7.5 ; U2.3 27,7.5 ; 27,7.5 Q2.3
$1N939: length 6.1
  Top Layer w0.508: U2.1 31.8,9.05 R3.2 R15.1
$1N940: length 6.1
  Top Layer w0.508: R14.2 R8.1 17.8,9.05 U3.1
$1N941: length 5.7
  Top Layer w0.508: R15.2 36,11.75 Q3.3
$1N942: length 6.1
  Top Layer w0.508: R17.1 R5.1 31.2,16.95 Q3.1
$1N945: length 6.1
  Top Layer w0.508: Q2.1 31.8,3.05 R7.1 R16.1
$1N948: length 5.7
  Top Layer w0.508: Q4.3 22,11.75 R14.1
$1N949: length 6.1
  Top Layer w0.508: R13.2 R10.1 17.8,3.05 Q1.1
$1N952: length 6.1
  Top Layer w0.508: Q4.1 17.2,16.95 R9.1 R18.2

## Copper pours and planes (outline as drawn; the poured copper is in the pictures)
VCC on Top Layer: 0,20 52,20 52,0 0,0
MOTOR2 on Bottom Layer: 0,20 52,20 52,0 0,0
